# Altium schematic sheet THERMO.SchDoc
size A4
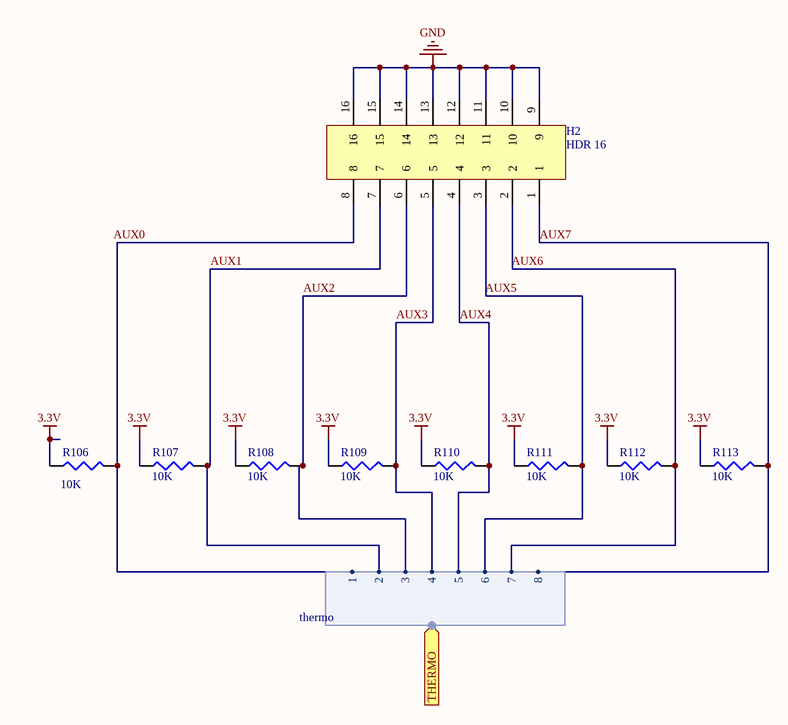
[diagram p0: THERMO.SchDoc]

## Parts
H2  HDR 16  [THERMO HDR]
R106  value 10K  [0603 RES]  (hidden comment: Res3)
R107  value 10K  [0603 RES]  (hidden comment: Res3)
R108  value 10K  [0603 RES]  (hidden comment: Res3)
R109  value 10K  [0603 RES]  (hidden comment: Res3)
R110  value 10K  [0603 RES]  (hidden comment: Res3)
R111  value 10K  [0603 RES]  (hidden comment: Res3)
R112  value 10K  [0603 RES]  (hidden comment: Res3)
R113  value 10K  [0603 RES]  (hidden comment: Res3)

## Ports
THERMO (harness thermo)

## Harnesses
thermo: 1, 2, 3, 4, 5, 6, 7, 8

## Nets
3.3V: R106.1 R107.1 R108.1 R109.1 R110.1 R111.1 R112.1 R113.1
GND: H2.9 H2.10 H2.11 H2.12 H2.13 H2.14 H2.15 H2.16
AUX1: H2.7 R107.2 ; port THERMO.2
AUX2: H2.6 R108.2 ; port THERMO.3
AUX3: H2.5 R109.2 ; port THERMO.4
AUX4: H2.4 R110.2 ; port THERMO.5
AUX7: H2.1 R113.2 ; port THERMO.8
NetH2_2: H2.2 R112.2 ; port THERMO.7
NetH2_3: H2.3 R111.2 ; port THERMO.6
NetH2_8: H2.8 R106.2 ; port THERMO.1

## Notes on the sheet
- Labels drawn without touching a wire or pin: AUX0, AUX5, AUX6

## Library data of the parts
H2 = HDR 16: Manufacturer: Molex; Manufacturer Part Number: 0430451601; Number of Positions: 16; Contact Resistance: 10mR; Max Voltage Rating (AC): 250V; Connector Type: Male Pin; Pitch: 3mm; Row Spacing: 0.118inch; Supplier 1: Digi-Key; Stock 1: 3016; Pricing 1: 1=4.7, 10=4.512, 100=3.7602, 792=2.9142, 1584=2.6321 (USD); Mount: Through Hole; Contact Plating: Gold; Contact Material: Brass; Colour: Black; Housing Material: Polymer; Housing Colour: Black; Min Operating Temperature: -40°C; Max Operating Temperature: 105°C; Packaging: Tray; Number of Rows: 2; Termination: Solder; Number of Contacts: 16; Orientation: Right Angle; Fastening Type: Ramp; Length: 28.15mm; Depth: 12.2mm; Supplier Part Number 1: WM7490-ND
R106-R113 = Res3: Resistor; Manufacturer: Vishay; Manufacturer Part Number: CRCW060310K0FKEA; Description: RES SMD 10K OHM 1% 1/10W 0603; Resistance: 10kR; Tolerance: 1%; Power Rating: 100mW; Voltage Rating: 75V; Temperature Coefficient: 100ppm/°C; Published: 8-Jun-2000; LatestRevisionDate: 29-May-2009; LatestRevisionNote: IPC-7351 Footprint Added.; PackageReference: J1-0603; Publisher: Altium Limited; PackageDescription: Chip Resistor; Supplier 1: Digi-Key; Supplier Part Number 1: 541-10.0KHCT-ND; Stock 1: 0; Pricing 1: 1=0.1, 10=0.042, 100=0.017, 1000=0.0076, 2500=0.0066 (USD); Case/Package: 0603; Number of Pins: 2; Weight: 7.1E-05oz; Case Code (Metric): 1608; Case Code (Imperial): 0603; Contact Plating: Lead,Tin; Min Operating Temperature: -55°C; Max Operating Temperature: 155°C; Packaging: Tape and Reel; Package Quantity: 10; Composition: Thick Film; Number of Terminations: 2; Military Standard: Not; Termination: SMD/SMT; Max Power Dissipation: 100mW; Voltage Rating (DC): 75V; Features: Automotive AEC-Q200; Length: 1.55mm; Height: 0.45mm; Width: 0.033inch; Depth: 0.85mm; Radiation Hardening: No; REACH SVHC: Unknown; Lead Free: Lead Free